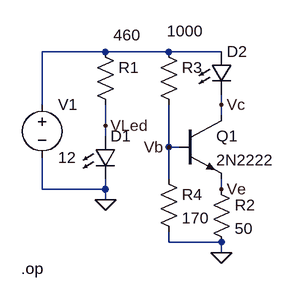
[diagram p0: schematic npn-current-source.asc]
npn-current-source.asc, the LTspice schematic file:
Version 4
SHEET 1 880 680
WIRE 160 16 64 16
WIRE 256 16 160 16
WIRE 336 16 256 16
WIRE 64 96 64 16
WIRE 336 96 336 80
WIRE 336 112 336 96
WIRE 160 128 160 96
WIRE 160 144 160 128
WIRE 256 160 256 96
WIRE 272 160 256 160
WIRE 256 208 256 160
WIRE 64 224 64 176
WIRE 160 224 160 208
WIRE 160 224 64 224
WIRE 336 224 336 208
WIRE 160 240 160 224
WIRE 256 304 256 288
WIRE 336 304 256 304
WIRE 336 320 336 304
FLAG 336 320 0
FLAG 160 240 0
FLAG 336 224 Ve
FLAG 336 96 Vc
FLAG 256 160 Vb
FLAG 160 128 VLed
SYMBOL LED 144 144 R0
WINDOW 3 24 64 Invisible 2
SYMATTR Value W5AP-LZMZ-5K8L
SYMATTR InstName D1
SYMBOL LED 320 16 R0
WINDOW 3 24 64 Invisible 2
SYMATTR Value W5AP-LZMZ-5K8L
SYMATTR InstName D2
SYMBOL res 144 0 R0
WINDOW 3 28 -9 Left 2
SYMATTR Value 460
SYMATTR InstName R1
SYMBOL res 320 208 R0
SYMATTR InstName R2
SYMATTR Value 50
SYMBOL npn 272 112 R0
SYMATTR InstName Q1
SYMATTR Value 2N2222
SYMBOL voltage 64 80 R0
SYMATTR InstName V1
SYMATTR Value 12
SYMBOL res 240 0 R0
WINDOW 3 13 -15 Left 2
SYMATTR Value 1000
SYMATTR InstName R3
SYMBOL res 240 192 R0
SYMATTR InstName R4
SYMATTR Value 170
TEXT 32 344 Left 2 !.op

The netlist it stands for:
* npn-current-source.asc
D1 VLed 0 W5AP-LZMZ-5K8L
D2 N001 Vc W5AP-LZMZ-5K8L
R1 N001 VLed 460
R2 Ve 0 50
Q1 Vc Vb Ve 0 2N2222
V1 N001 0 12
R3 N001 Vb 1000
R4 Vb 0 170
.model D D
.lib standard.dio
.model NPN NPN
.model PNP PNP
.lib standard.bjt
.op
.backanno
.end